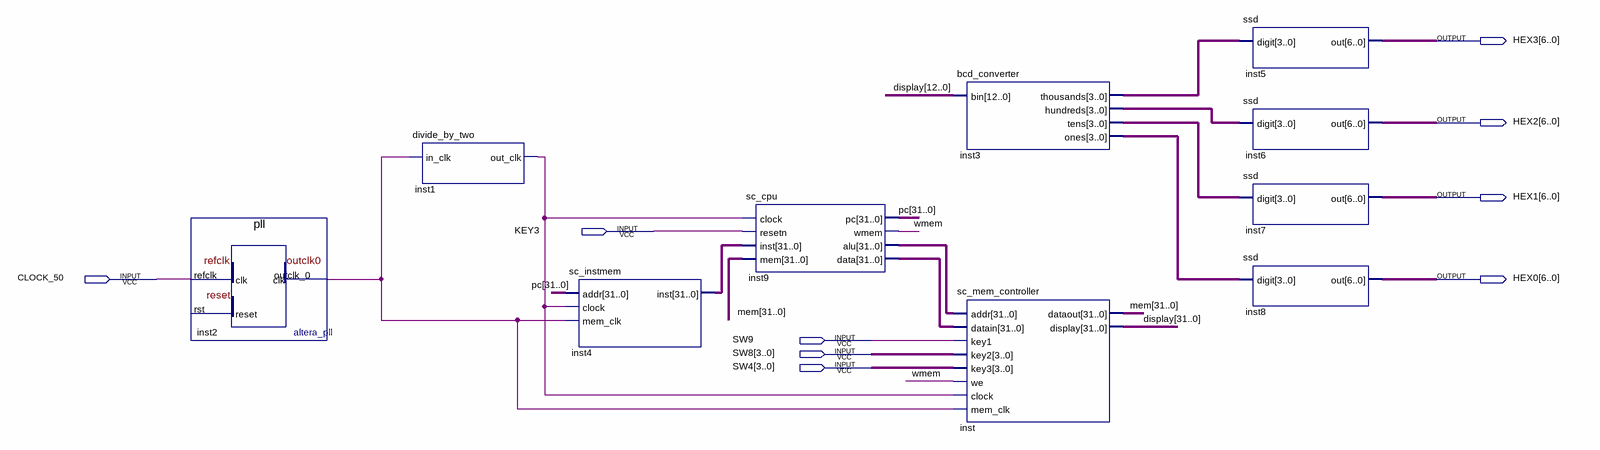
[diagram p0: schematic sheet]
// Quartus schematic single_cycle_computer.bdf as structural Verilog: 10 symbols, 9 pins
module single_cycle_computer (
  input  KEY3,
  input  CLOCK_50,
  input  SW9,
  input  [3:0] SW8,
  input  [3:0] SW4,
  output [6:0] HEX3,
  output [6:0] HEX2,
  output [6:0] HEX1,
  output [6:0] HEX0
);

  wire inst1_out_clk, inst2_outclk_0, wmem;
  wire [3:0] inst3_hundreds, inst3_ones, inst3_tens, inst3_thousands;
  wire [31:0] display, inst4_inst, inst9_alu, inst9_data, mem, pc;

  pll inst2 (.refclk(CLOCK_50), .outclk_0(inst2_outclk_0));  // open: rst
  divide_by_two inst1 (.in_clk(inst2_outclk_0), .out_clk(inst1_out_clk));
  sc_instmem inst4 (.addr(pc), .clock(inst1_out_clk), .mem_clk(inst2_outclk_0), .inst(inst4_inst));
  sc_cpu inst9 (
    .clock(inst1_out_clk), .resetn(KEY3), .inst(inst4_inst), .mem(mem), .pc(pc), .wmem(wmem),
    .alu(inst9_alu), .data(inst9_data));
  bcd_converter inst3 (
    .bin(display[12:0]), .thousands(inst3_thousands), .hundreds(inst3_hundreds), .tens(inst3_tens),
    .ones(inst3_ones));
  sc_mem_controller inst (
    .addr(inst9_alu), .datain(inst9_data), .key1(SW9), .key2(SW8), .key3(SW4), .we(wmem),
    .clock(inst1_out_clk), .mem_clk(inst2_outclk_0), .dataout(mem), .display(display));
  ssd inst5 (.digit(inst3_thousands), .out(HEX3));
  ssd inst6 (.digit(inst3_hundreds), .out(HEX2));
  ssd inst7 (.digit(inst3_tens), .out(HEX1));
  ssd inst8 (.digit(inst3_ones), .out(HEX0));
endmodule
